# Altium schematic sheet STM32.SchDoc
size B
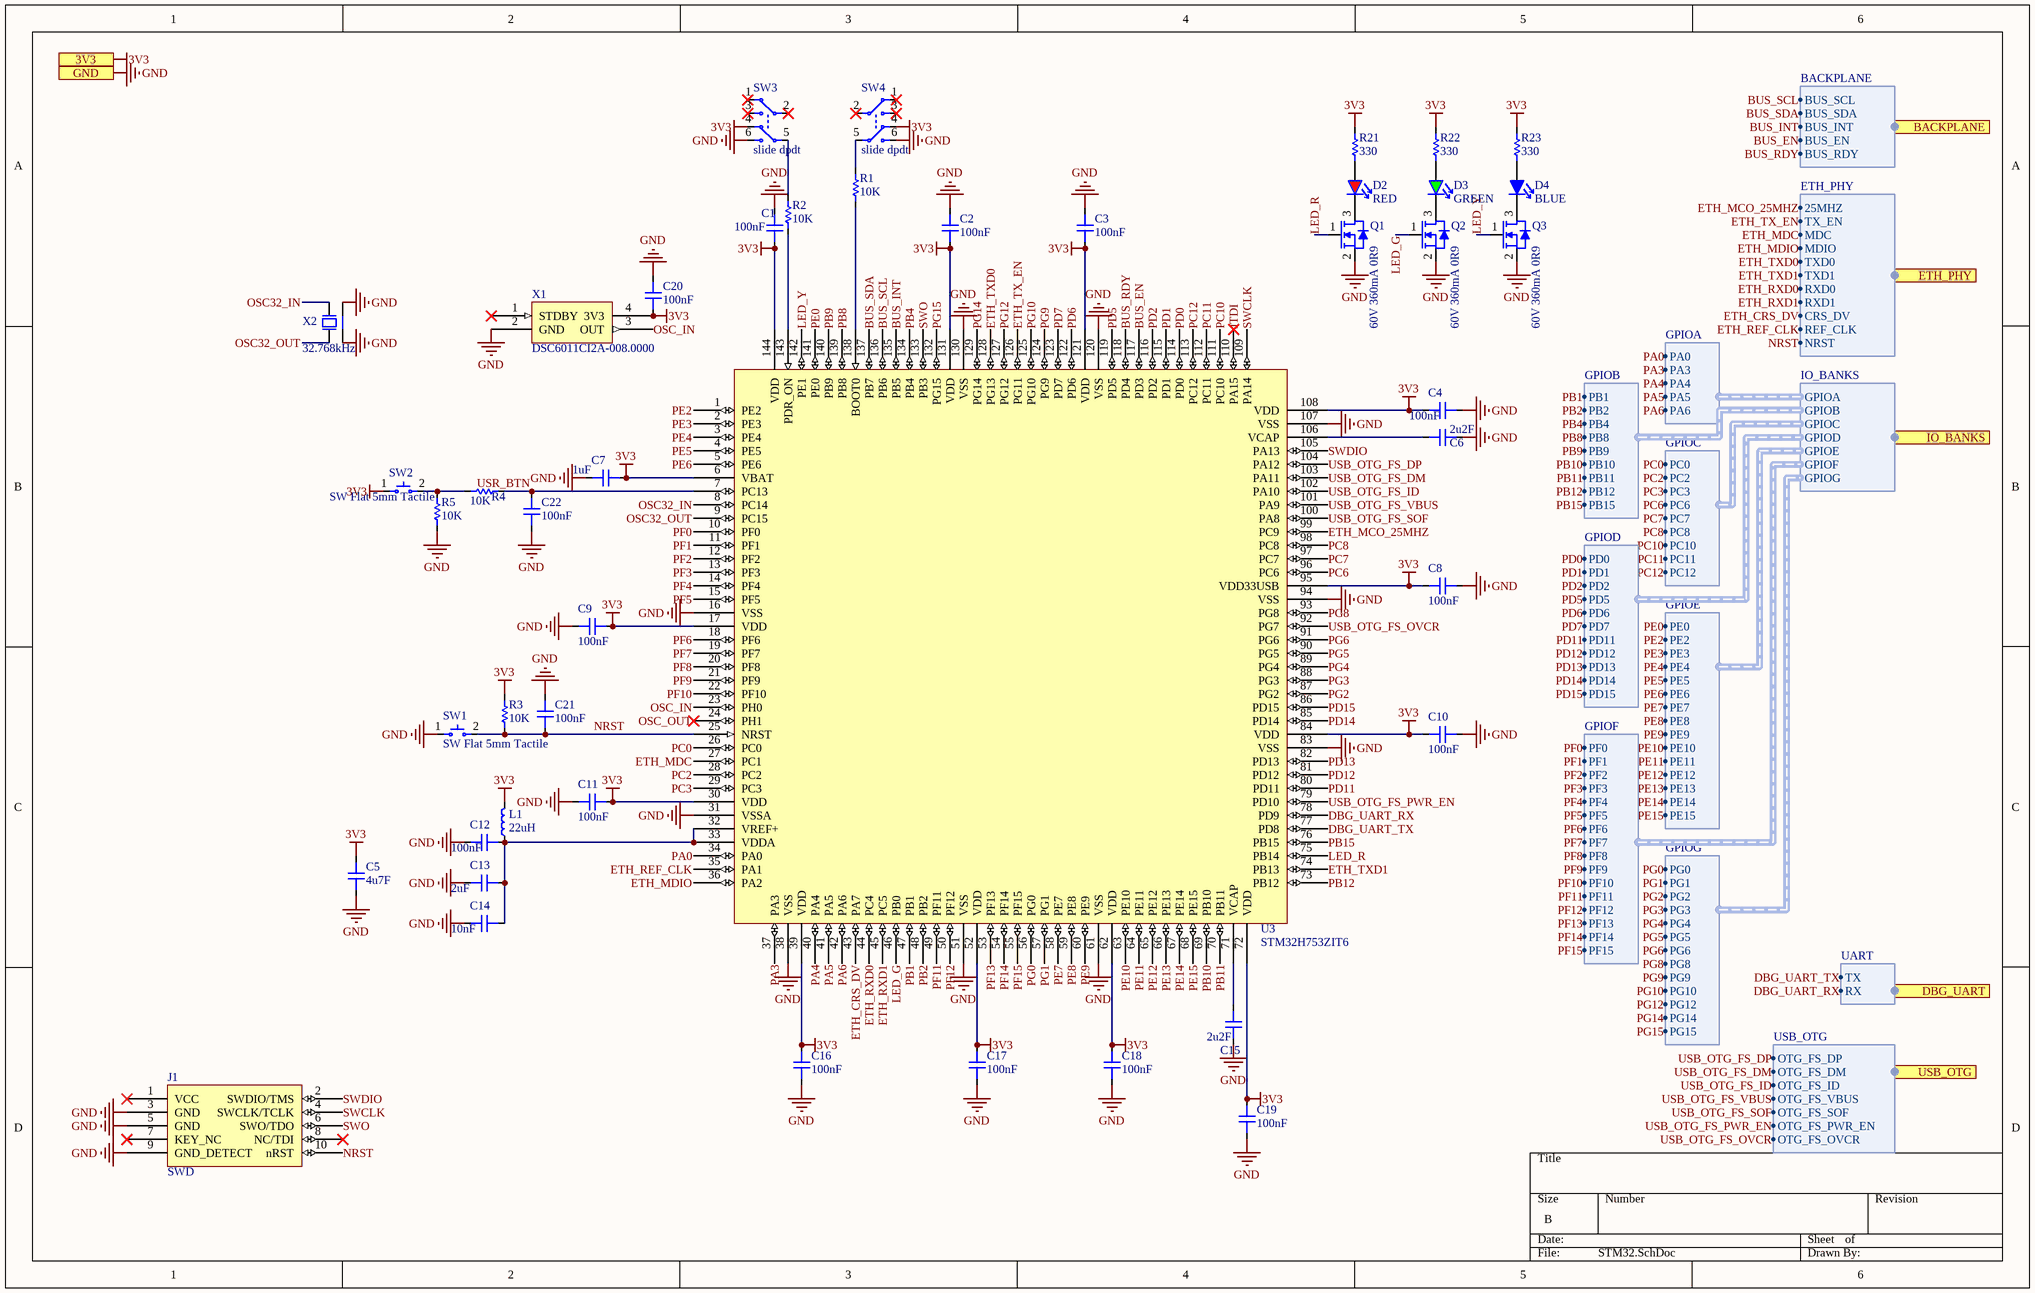
[diagram p0: STM32.SchDoc]

## Parts
C1  100nF  [CAP 0805 L]
C2  100nF  [CAP 0805 L]
C3  100nF  [CAP 0805 L]
C4  100nF  [CAP 0805 L]
C5  4u7F  [CAP 0805 L]
C6  2u2F  [CAP 0805 L]
C7  1uF  [CAP 0805 L]
C8  100nF  [CAP 0805 L]
C9  100nF  [CAP 0805 L]
C10  100nF  [CAP 0805 L]
C11  100nF  [CAP 0805 L]
C12  100nF  [CAP 0805 L]
C13  2uF  [CAP 0805 L]
C14  10nF  [CAP 0805 L]
C15  2u2F  [CAP 0805 L]
C16  100nF  [CAP 0805 L]
C17  100nF  [CAP 0805 L]
C18  100nF  [CAP 0805 L]
C19  100nF  [CAP 0805 L]
C20  100nF  [CAP 0805 L]
C21  100nF  [CAP 0805 L]
C22  100nF  [CAP 0805 L]
D2  RED  [LED 0603 RED]
D3  GREEN  [LED 0603 GREEN]
D4  BLUE  [LED 0603 BLUE]
J1  SWD  [CONN IDC 10P P0.05]
L1  22uH  [IND 0805 L]
Q1  60V 360mA 0R9  [SOT23]
Q2  60V 360mA 0R9  [SOT23]
Q3  60V 360mA 0R9  [SOT23]
R1  10K  [RES 0603 L]
R2  10K  [RES 0603 L]
R3  10K  [RES 0603 L]
R4  10K  [RES 0603 L]
R5  10K  [RES 0603 L]
R21  330  [RES 0603 L]
R22  330  [RES 0603 L]
R23  330  [RES 0603 L]
SW1  SW Flat 5mm Tactile  [SW 5MM TACTILE]
SW2  SW Flat 5mm Tactile  [SW 5MM TACTILE]
SW3  slide dpdt  [SW SIDE SLIDE DPDT]
SW4  slide dpdt  [SW SIDE SLIDE DPDT]
U3  STM32H753ZIT6  [LQFP144]
X1  DSC6011CI2A-008.0000  [XO 3.2x2.5]
X2  32.768kHz  [XTAL 8.0x3.8]

## Ports
3V3, BACKPLANE (harness BACKPLANE), DBG_UART (harness UART), ETH_PHY (harness ETH_PHY), GND, IO_BANKS (harness IO_BANKS), USB_OTG (harness USB_OTG)

## Harnesses
BACKPLANE: BUS_SCL, BUS_SDA, BUS_INT, BUS_EN, BUS_RDY
ETH_PHY: 25MHZ, TX_EN, MDC, MDIO, TXD0, TXD1, RXD0, RXD1, CRS_DV, REF_CLK, NRST
IO_BANKS: GPIOA, GPIOB, GPIOC, GPIOD, GPIOE, GPIOF, GPIOG
GPIOA: PA0, PA3, PA4, PA5, PA6
GPIOB: PB1, PB2, PB4, PB8, PB9, PB10, PB11, PB12, PB15
GPIOC: PC0, PC2, PC3, PC6, PC7, PC8, PC10, PC11, PC12
GPIOD: PD0, PD1, PD2, PD5, PD6, PD7, PD11, PD12, PD13, PD14, PD15
GPIOE: PE0, PE2, PE3, PE4, PE5, PE6, PE7, PE8, PE9, PE10, PE11, PE12, PE13, PE14, PE15
GPIOF: PF0, PF1, PF2, PF3, PF4, PF5, PF6, PF7, PF8, PF9, PF10, PF11, PF12, PF13, PF14, PF15
GPIOG: PG0, PG1, PG2, PG3, PG4, PG5, PG6, PG8, PG9, PG10, PG12, PG14, PG15
USB_OTG: OTG_FS_DP, OTG_FS_DM, OTG_FS_ID, OTG_FS_VBUS, OTG_FS_SOF, OTG_FS_PWR_EN, OTG_FS_OVCR
UART: TX, RX

## Nets
3V3: C1.1 C2.1 C3.1 C4.1 C5.1 C7.2 C8.1 C9.2 C10.1 C11.2 C16.2 C17.2 C18.2 C19.2 C20.1 L1.2 R3.2 R21.2 R22.2 R23.2 SW2.1 SW3.4 SW4.4 U3.6(VBAT) U3.17(VDD) U3.30(VDD) U3.39(VDD) U3.52(VDD) U3.62(VDD) U3.72(VDD) U3.84(VDD) U3.95(VDD33USB) U3.108(VDD) U3.121(VDD) U3.131(VDD) U3.144(VDD) X1.4(3V3) ; port 3V3
GND: C1.2 C2.2 C3.2 C4.2 C5.2 C6.2 C7.1 C8.2 C9.1 C10.2 C11.1 C12.1 C13.1 C14.1 C15.1 C16.1 C17.1 C18.1 C19.1 C20.2 C21.2 C22.1 J1.3(GND) J1.5(GND) J1.9(GND_DETECT) Q1.2 Q2.2 Q3.2 R5.1 SW1.1 SW3.6 SW4.6 U3.16(VSS) U3.31(VSSA) U3.38(VSS) U3.51(VSS) U3.61(VSS) U3.83(VSS) U3.94(VSS) U3.107(VSS) U3.120(VSS) U3.130(VSS) X1.2(GND) X2.2 X2.3 ; port GND
BUS_EN: U3.117(PD3) ; port BACKPLANE.BUS_EN
BUS_INT: U3.135(PB5) ; port BACKPLANE.BUS_INT
BUS_RDY: U3.118(PD4) ; port BACKPLANE.BUS_RDY
BUS_SCL: U3.136(PB6) ; port BACKPLANE.BUS_SCL
BUS_SDA: U3.137(PB7) ; port BACKPLANE.BUS_SDA
DBG_UART_RX: U3.78(PD9) ; port DBG_UART.RX
DBG_UART_TX: U3.77(PD8) ; port DBG_UART.TX
ETH_CRS_DV: U3.43(PA7) ; port ETH_PHY.CRS_DV
ETH_MCO_25MHZ: U3.99(PC9) ; port ETH_PHY.25MHZ
ETH_MDC: U3.27(PC1) ; port ETH_PHY.MDC
ETH_MDIO: U3.36(PA2) ; port ETH_PHY.MDIO
ETH_REF_CLK: U3.35(PA1) ; port ETH_PHY.REF_CLK
ETH_RXD0: U3.44(PC4) ; port ETH_PHY.RXD0
ETH_RXD1: U3.45(PC5) ; port ETH_PHY.RXD1
ETH_TX_EN: U3.126(PG11) ; port ETH_PHY.TX_EN
ETH_TXD0: U3.128(PG13) ; port ETH_PHY.TXD0
ETH_TXD1: U3.74(PB13) ; port ETH_PHY.TXD1
JTDI: U3.110(PA15)
LED_G: Q2.1 U3.46(PB0)
LED_R: Q1.1 U3.75(PB14)
LED_Y: Q3.1 U3.142(PE1)
NRST: C21.1 J1.10(nRST) R3.1 SW1.2 U3.25(NRST) ; port ETH_PHY.NRST
OSC32_IN: U3.8(PC14) X2.4
OSC32_OUT: U3.9(PC15) X2.1
OSC_IN: U3.23(PH0) X1.3(OUT)
OSC_OUT: U3.24(PH1)
PA0: U3.34(PA0) ; harness GPIOA.PA0
PA3: U3.37(PA3) ; harness GPIOA.PA3
PA4: U3.40(PA4) ; harness GPIOA.PA4
PA5: U3.41(PA5) ; harness GPIOA.PA5
PA6: U3.42(PA6)
PB1: U3.47(PB1) ; harness GPIOB.PB1
PB2: U3.48(PB2) ; harness GPIOB.PB2
PB4: U3.134(PB4) ; harness GPIOB.PB4
PB8: U3.139(PB8) ; harness GPIOB.PB8
PB9: U3.140(PB9) ; harness GPIOB.PB9
PB10: U3.69(PB10) ; harness GPIOB.PB10
PB11: U3.70(PB11) ; harness GPIOB.PB11
PB12: U3.73(PB12) ; harness GPIOB.PB12
PB15: U3.76(PB15) ; harness GPIOB.PB15
PC0: U3.26(PC0) ; harness GPIOC.PC0
PC2: U3.28(PC2) ; harness GPIOC.PC2
PC3: U3.29(PC3) ; harness GPIOC.PC3
PC6: U3.96(PC6) ; harness GPIOC.PC6
PC7: U3.97(PC7) ; harness GPIOC.PC7
PC8: U3.98(PC8) ; harness GPIOC.PC8
PC10: U3.111(PC10) ; harness GPIOC.PC10
PC11: U3.112(PC11) ; harness GPIOC.PC11
PC12: U3.113(PC12) ; harness GPIOC.PC12
PD0: U3.114(PD0) ; harness GPIOD.PD0
PD1: U3.115(PD1) ; harness GPIOD.PD1
PD2: U3.116(PD2) ; harness GPIOD.PD2
PD5: U3.119(PD5) ; harness GPIOD.PD5
PD6: U3.122(PD6) ; harness GPIOD.PD6
PD7: U3.123(PD7) ; harness GPIOD.PD7
PD11: U3.80(PD11) ; harness GPIOD.PD11
PD12: U3.81(PD12) ; harness GPIOD.PD12
PD13: U3.82(PD13) ; harness GPIOD.PD13
PD14: U3.85(PD14) ; harness GPIOD.PD14
PD15: U3.86(PD15) ; harness GPIOD.PD15
PE0: U3.141(PE0) ; harness GPIOE.PE0
PE2: U3.1(PE2) ; harness GPIOE.PE2
PE3: U3.2(PE3) ; harness GPIOE.PE3
PE4: U3.3(PE4) ; harness GPIOE.PE4
PE5: U3.4(PE5) ; harness GPIOE.PE5
PE6: U3.5(PE6) ; harness GPIOE.PE6
PE7: U3.58(PE7) ; harness GPIOE.PE7
PE8: U3.59(PE8) ; harness GPIOE.PE8
PE9: U3.60(PE9) ; harness GPIOE.PE9
PE10: U3.63(PE10) ; harness GPIOE.PE10
PE11: U3.64(PE11) ; harness GPIOE.PE11
PE12: U3.65(PE12) ; harness GPIOE.PE12
PE13: U3.66(PE13) ; harness GPIOE.PE13
PE14: U3.67(PE14) ; harness GPIOE.PE14
PE15: U3.68(PE15) ; harness GPIOE.PE15
PF0: U3.10(PF0) ; harness GPIOF.PF0
PF1: U3.11(PF1) ; harness GPIOF.PF1
PF2: U3.12(PF2) ; harness GPIOF.PF2
PF3: U3.13(PF3) ; harness GPIOF.PF3
PF4: U3.14(PF4) ; harness GPIOF.PF4
PF5: U3.15(PF5) ; harness GPIOF.PF5
PF6: U3.18(PF6) ; harness GPIOF.PF6
PF7: U3.19(PF7) ; harness GPIOF.PF7
PF8: U3.20(PF8) ; harness GPIOF.PF8
PF9: U3.21(PF9) ; harness GPIOF.PF9
PF10: U3.22(PF10) ; harness GPIOF.PF10
PF11: U3.49(PF11) ; harness GPIOF.PF11
PF12: U3.50(PF12) ; harness GPIOF.PF12
PF13: U3.53(PF13) ; harness GPIOF.PF13
PF14: U3.54(PF14) ; harness GPIOF.PF14
PF15: U3.55(PF15) ; harness GPIOF.PF15
PG0: U3.56(PG0) ; harness GPIOG.PG0
PG1: U3.57(PG1) ; harness GPIOG.PG1
PG2: U3.87(PG2) ; harness GPIOG.PG2
PG3: U3.88(PG3) ; harness GPIOG.PG3
PG4: U3.89(PG4) ; harness GPIOG.PG4
PG5: U3.90(PG5) ; harness GPIOG.PG5
PG6: U3.91(PG6) ; harness GPIOG.PG6
PG8: U3.93(PG8) ; harness GPIOG.PG8
PG9: U3.124(PG9) ; harness GPIOG.PG9
PG10: U3.125(PG10) ; harness GPIOG.PG10
PG12: U3.127(PG12) ; harness GPIOG.PG12
PG14: U3.129(PG14) ; harness GPIOG.PG14
PG15: U3.132(PG15) ; harness GPIOG.PG15
SWCLK: J1.4(SWCLK/TCLK) U3.109(PA14)
SWDIO: J1.2(SWDIO/TMS) U3.105(PA13)
SWO: J1.6(SWO/TDO) U3.133(PB3)
USB_OTG_FS_DM: U3.103(PA11) ; port USB_OTG.OTG_FS_DM
USB_OTG_FS_DP: U3.104(PA12) ; port USB_OTG.OTG_FS_DP
USB_OTG_FS_ID: U3.102(PA10) ; port USB_OTG.OTG_FS_ID
USB_OTG_FS_OVCR: U3.92(PG7) ; port USB_OTG.OTG_FS_OVCR
USB_OTG_FS_PWR_EN: U3.79(PD10) ; port USB_OTG.OTG_FS_PWR_EN
USB_OTG_FS_SOF: U3.100(PA8) ; port USB_OTG.OTG_FS_SOF
USB_OTG_FS_VBUS: U3.101(PA9) ; port USB_OTG.OTG_FS_VBUS
USR_BTN: C22.2 R4.1 U3.7(PC13)
NetC6_1: C6.1 U3.106(VCAP)
NetC12_2: C12.2 C13.2 C14.2 L1.1 U3.32(VREF+) U3.33(VDDA)
NetC15_2: C15.2 U3.71(VCAP)
NetD2_1: D2.1 Q1.3
NetD2_2: D2.2 R21.1
NetD3_1: D3.1 Q2.3
NetD3_2: D3.2 R22.1
NetD4_1: D4.1 Q3.3
NetD4_2: D4.2 R23.1
NetR1_1: R1.1 U3.138(BOOT0)
NetR1_2: R1.2 SW4.5
NetR2_1: R2.1 U3.143(PDR_ON)
NetR2_2: R2.2 SW3.5
NetR4_2: R4.2 R5.2 SW2.2

Not connected (* = marked no-connect by the designer): J1 1(VCC)* 7(KEY_NC)* 8(NC/TDI)*; SW3 1* 2* 3*; SW4 1* 2* 3*; X1 1(STDBY)*

## Notes on the sheet
- Labels drawn without touching a wire or pin: PA6

## Library data of the parts
C1-C22 = CAP 0805
D2 = LED 0603 RED
D3 = LED 0603 GREEN
D4 = LED 0603 BLUE
J1 = CONN SWD IDC 0.05: Supplier 1: Digi-Key; Supplier Part Number 1: 1175-1735-ND
L1 = IND 0805
Q1-Q3 = FET 60V 360mA 0R9: PMN20ENAX; Supplier 1: Digi-Key; Supplier Part Number 1: 1727-1142-1-ND
R1-R5 R21-R23 = RES 0603
SW3 SW4 = SW horz slide dpdt: JS202011JAQN; Supplier 1: Digi-Key; Supplier Part Number 1: CKN10722CT-ND
X1 = XO MEMS 8MHz
X2 = XTAL 32.768kHz: RSM200S-32.768-12.5-10PPM-NPB